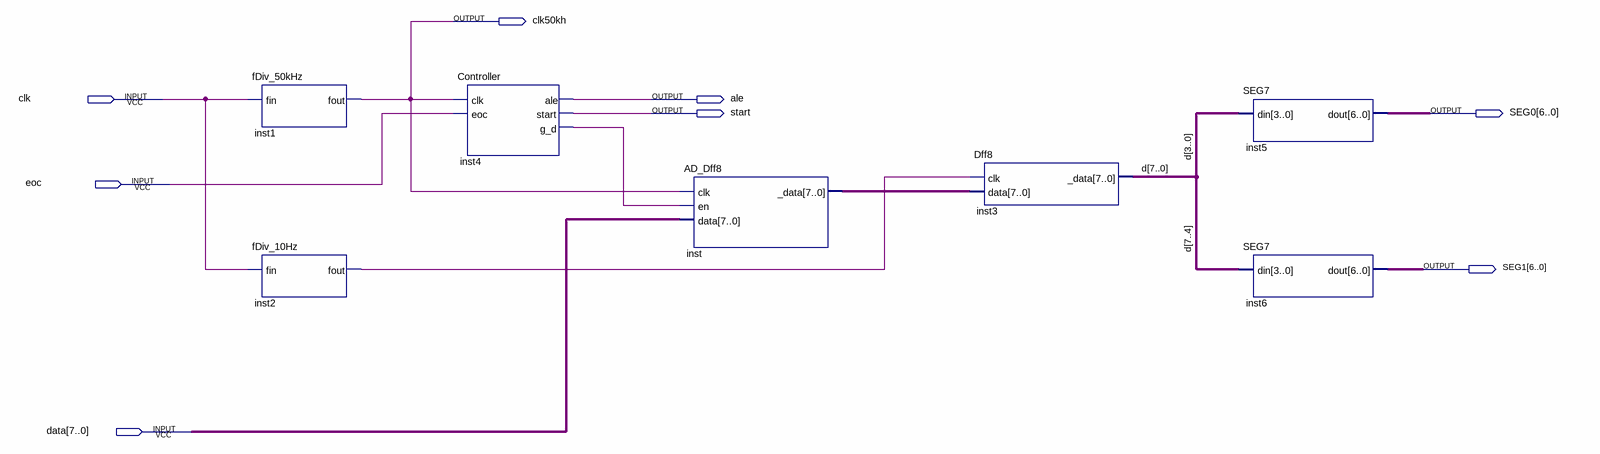
[diagram p0: schematic sheet]
// Quartus schematic lab5.bdf as structural Verilog: 7 symbols, 8 pins
module lab5 (
  input  clk,
  input  eoc,
  input  [7:0] data,
  output clk50kh,
  output ale,
  output start,
  output [6:0] SEG0,
  output [6:0] SEG1
);

  wire inst2_fout, inst4_g_d;
  wire [7:0] d, inst__data;

  fDiv_50kHz inst1 (.fin(clk), .fout(clk50kh));
  fDiv_10Hz inst2 (.fin(clk), .fout(inst2_fout));
  Controller inst4 (.clk(clk50kh), .eoc(eoc), .ale(ale), .start(start), .g_d(inst4_g_d));
  AD_Dff8 inst (.clk(clk50kh), .en(inst4_g_d), .data(data), ._data(inst__data));
  Dff8 inst3 (.clk(inst2_fout), .data(inst__data), ._data(d));
  SEG7 inst5 (.din(d[3:0]), .dout(SEG0));
  SEG7 inst6 (.din(d[7:4]), .dout(SEG1));
endmodule
